# Altium schematic sheet Sheet2.SchDoc
size A; SheetNumber: 1; SheetTotal: 1
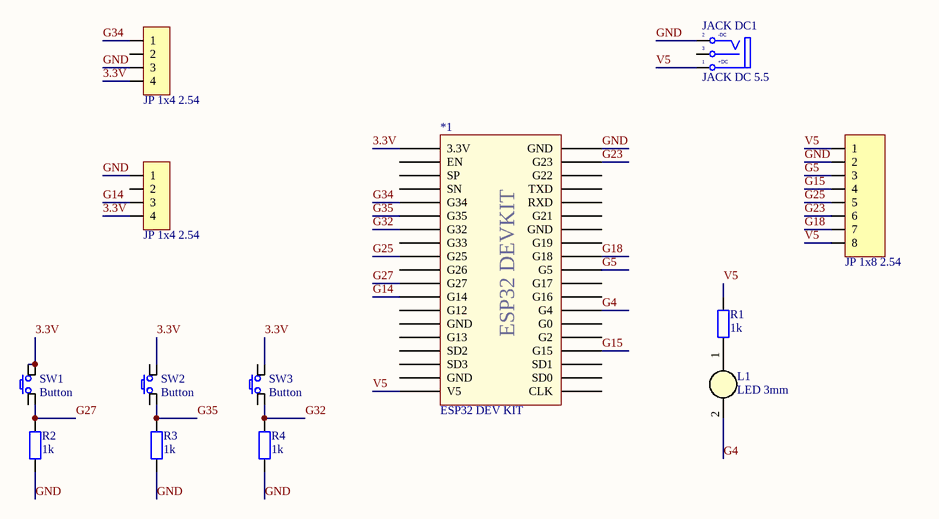
[diagram p0: Sheet2.SchDoc]

## Parts
*1  ESP32 DEV KIT  [ESP32 DEVKIT]
JACK_DC1  JACK DC 5.5  [JACK DC 5.5]
JP1  JP 1x4 2.54  [JP 1x4 DT]
JP2  JP 1x8 2.54  [JP 1x8 DT]
JP3  JP 1x4 2.54  [JP 1x4 DT]
L1  LED 3mm  [LED-3MM-WHITE]
R1  1k  [tro vach 1/2w]
R2  1k  [tro vach 1/2w]
R3  1k  [tro vach 1/2w]
R4  1k  [tro vach 1/2w]
SW1  Button  [SW/4/06MM]
SW2  Button  [SW/4/06MM]
SW3  Button  [SW/4/06MM]

## Nets
3.3V: *1.1(3.3V) JP1.4 JP3.4 SW1.3 SW1.4 SW2.4 SW3.4
G4: *1.26(G4) L1.2(K)
G5: *1.29(G5) JP2.3
G14: *1.12(G14) JP3.3
G15: *1.23(G15) JP2.4
G18: *1.30(G18) JP2.7
G23: *1.37(G23) JP2.6
G25: *1.9(G25) JP2.5
G27: *1.11(G27) R2.2 SW1.2
G32: *1.7(G32) R4.2 SW3.2
G34: *1.5(G34) JP1.1
G35: *1.6(G35) R3.2 SW2.2
GND: *1.38(GND) JACK_DC1.2(TN) JP1.3 JP2.2 JP3.1 R2.1 R3.1 R4.1
V5: *1.19(V5) JACK_DC1.1(T) JP2.1 JP2.8 R1.2
NetL1_1: L1.1(A) R1.1

Not connected (* = marked no-connect by the designer): *1 2(EN) 3(SP) 4(SN) 8(G33) 10(G26) 13(G12) 14(GND) 15(G13) 16(SD2) 17(SD3) 18(GND) 20(CLK) 21(SD0) 22(SD1) 24(G2) 25(G0) 27(G16) 28(G17) 31(G19) 32(GND) 33(G21) 34(RXD) 35(TXD) 36(G22); JACK_DC1 3(S); JP1 2; JP3 2; SW1 1; SW2 1 3; SW3 1 3

## Notes on the sheet
- (in symbol ESP32 DEV KIT) ESP32 DEVKIT
- (in symbol JACK DC 5.5) -DC; +DC

## Library data of the parts
JACK_DC1 = JACK DC 5.5: Value: Jac DC
JP1 JP3 = JP 1x4 2.54 Duc Thang: Cắm; Ten_Linh_Kien: Jump Đơn Đực 2.54MM 1x40P Thẳng 11MM; Don_Vi: Con; Ma_Hang: MH000903; Ghi_Chu: *; Kieu_Chan: *; Chung_Loai: Cắm
JP2 = JP 1x8 2.54 Duc Thang: Cắm; Ten_Linh_Kien: Jump Đơn Đực 2.54MM 1x40P Thẳng 11MM; Don_Vi: Con; Ma_Hang: MH000903; Ghi_Chu: *; Kieu_Chan: *; Chung_Loai: Cắm
L1 = LED 3mm Trang: Cắm; Don_Vi: Con; Ma_Hang: MH009001; Ten_Linh_Kien: LED 3MM Trắng SS (1000c); Ghi_Chu: *; Kieu_Chan: *; Chung_Loai: Cắm
R1-R4 = Tro Vach 1/2W 5% 1k: Cắm; Don_Vi: Con; So_Chan: 2; Ten_Linh_Kien: Trở 5% 1/2w 1K; Ma_Hang: MH007240; Chung_Loai: Cắm; Kieu_Chan: *
SW1-SW3 = SW SPST 4-pin: Tact switch 4-pin